# EAGLE design photoduino.shield.v.2.0 (EAGLE 5.10)
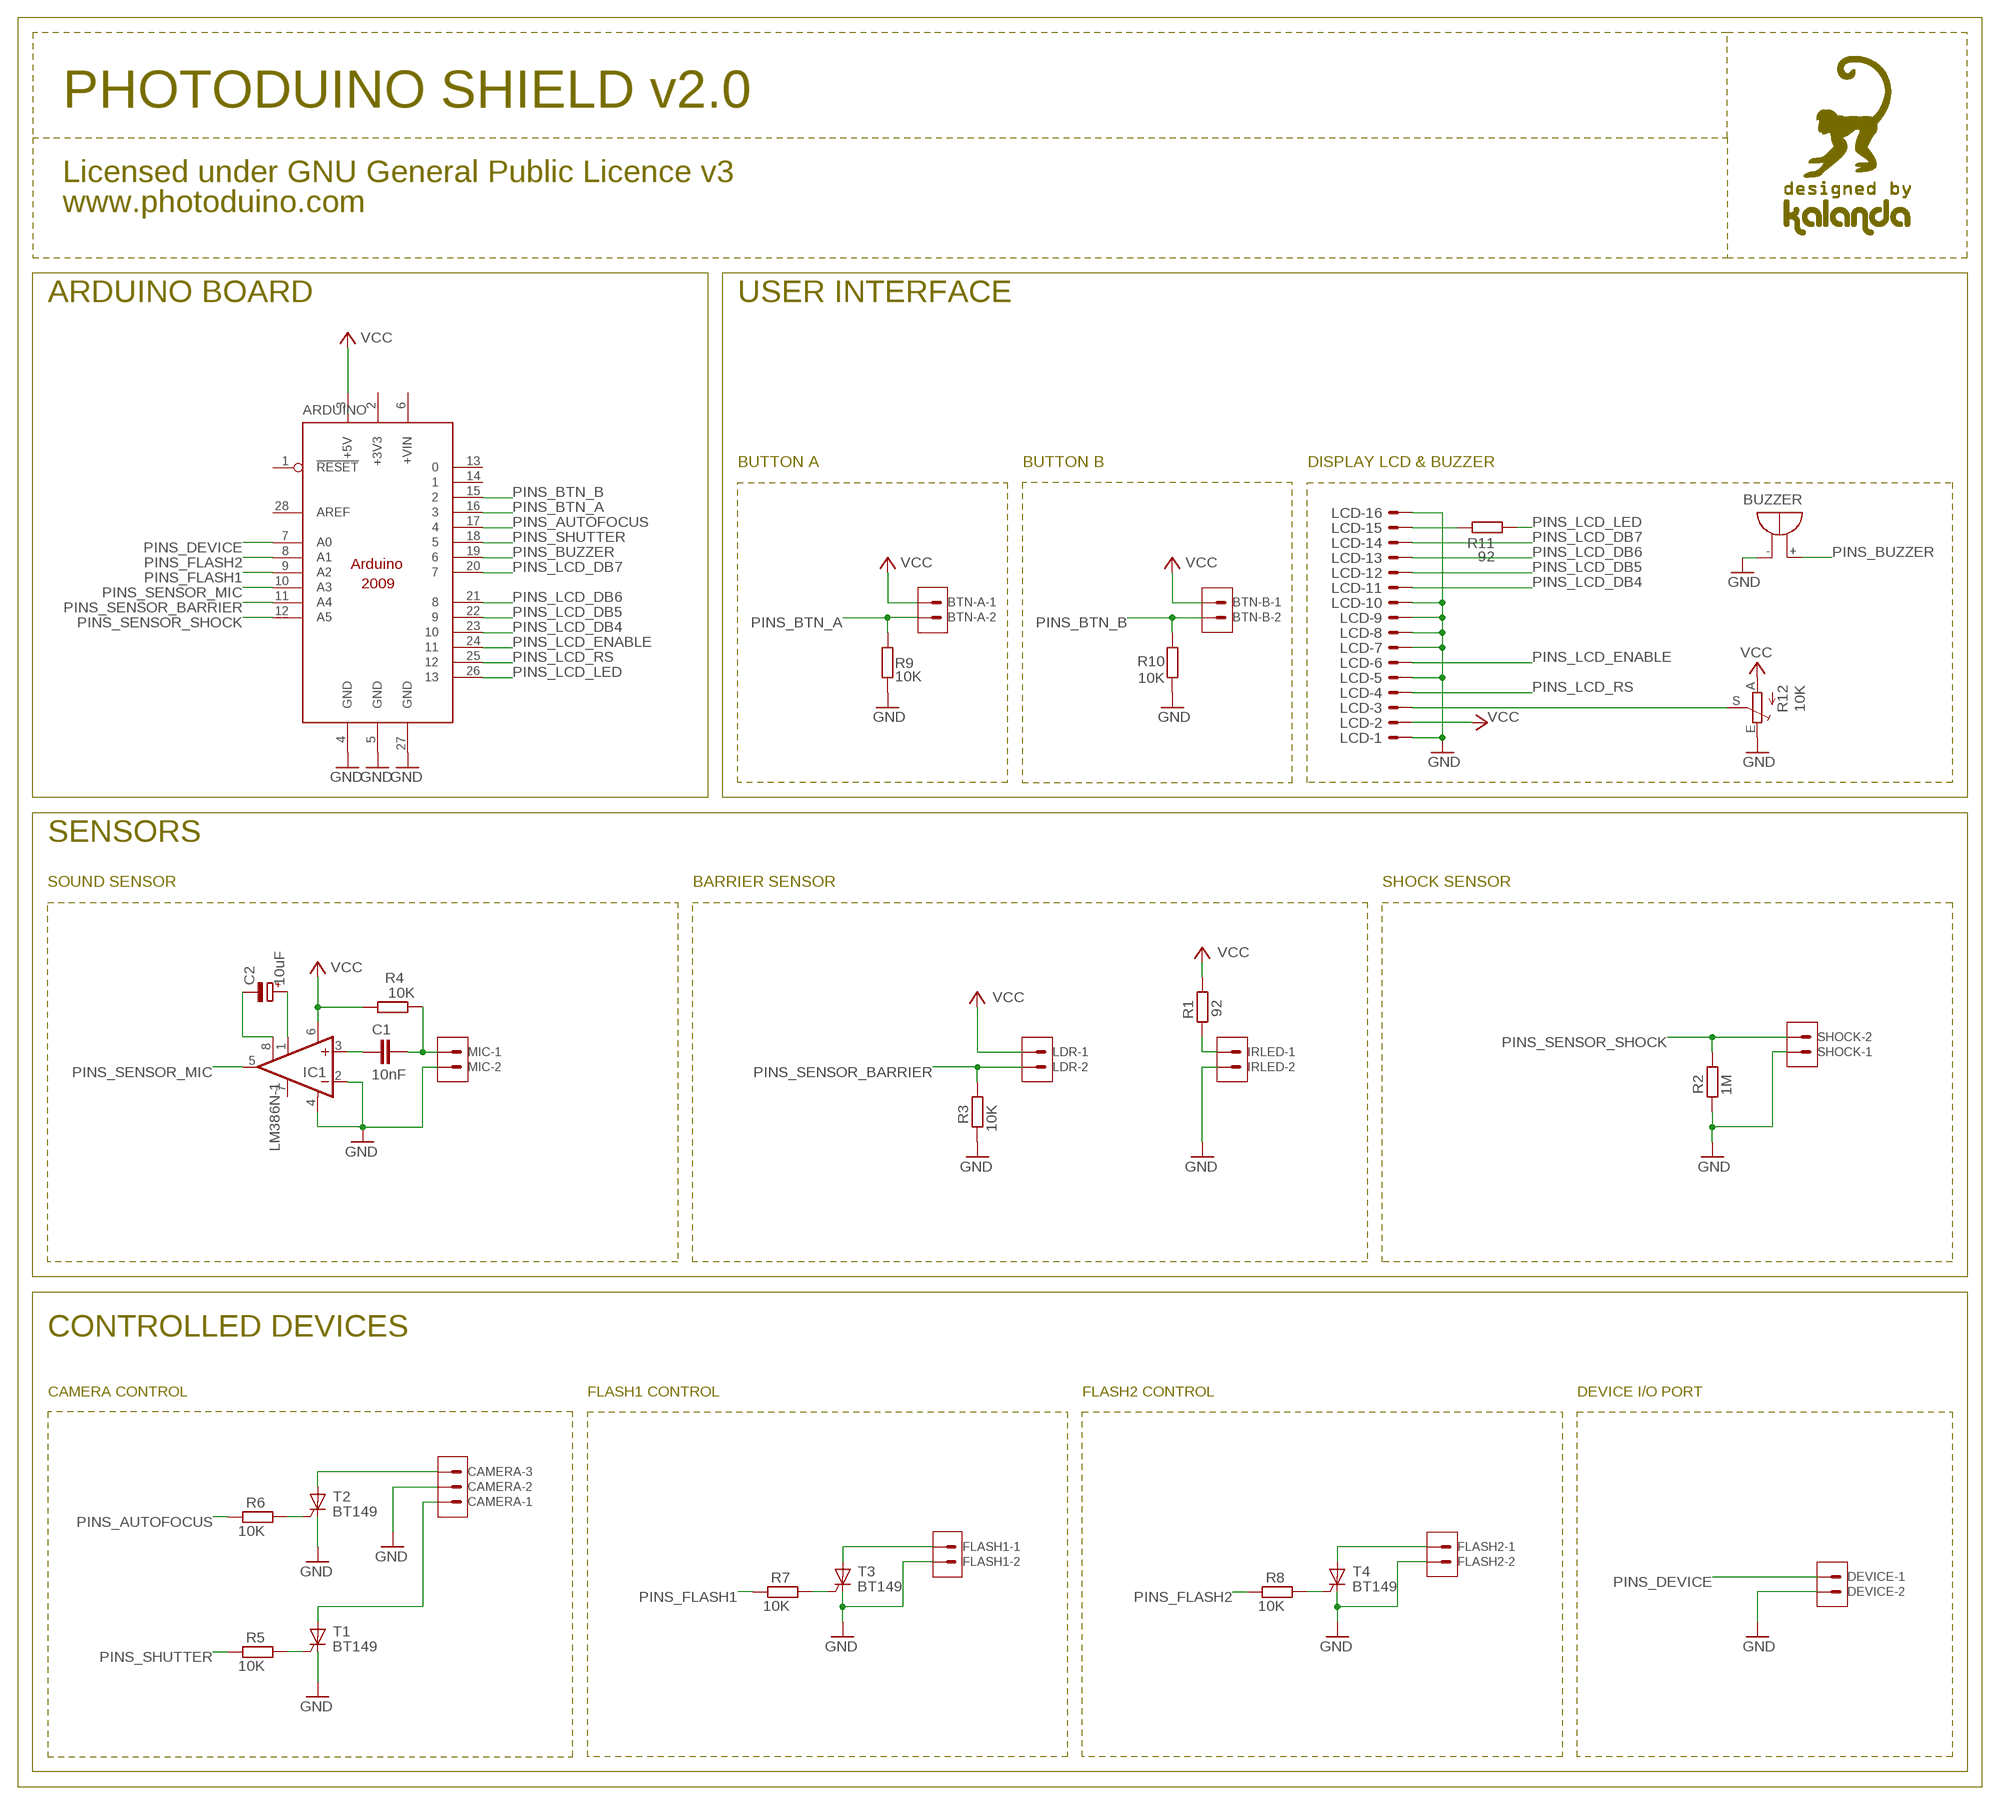
[diagram p0: schematic, sheet 1]

## Parts
ARDUINO  ARDUINO2009_11  [ARDUINO2009_1]
BTN-A  22-27-2021-02  [6410-02]
BTN-B  22-27-2021-02  [6410-02]
BUZZER  F/TMB  [F/TMB]
C1  10nF  C-EU050-025X075  [C050-025X075]
C2  10uF  CPOL-EUE2.5-6  [E2,5-6]
CAMERA  22-27-2031-03  [6410-03]
DEVICE  22-27-2021-02  [6410-02]
FLASH1  22-27-2021-02  [6410-02]
FLASH2  22-27-2021-02  [6410-02]
IC1  LM386N-1  [DIL08]
IRLED  22-27-2021-02  [6410-02]
LCD  ML16E  [ML16]
LDR  22-27-2021-02  [6410-02]
LOGO  LOGOKALANDA  [LOGOKALANDA]
MIC  22-27-2021-02  [6410-02]
R1  92  R-EU_0207/7  [0207/7]
R2  1M  R-EU_0207/7  [0207/7]
R3  10K  R-EU_0207/7  [0207/7]
R4  10K  R-EU_0207/7  [0207/7]
R5  10K  R-EU_0207/7  [0207/7]
R6  10K  R-EU_0207/7  [0207/7]
R7  10K  R-EU_0207/7  [0207/7]
R8  10K  R-EU_0207/7  [0207/7]
R9  10K  R-EU_0207/7  [0207/7]
R10  10K  R-EU_0207/7  [0207/7]
R11  92  R-EU_0207/7  [0207/7]
R12  10K  TRIM_EU-RJ9W  [RJ9W]
SHOCK  22-27-2021-02  [6410-02]
T1  BT149  [TO92-4]
T2  BT149  [TO92-4]
T3  BT149  [TO92-4]
T4  BT149  [TO92-4]

## Nets
GND: ARDUINO.4(GND) ARDUINO.5(GND) ARDUINO.27(GND) BUZZER.- CAMERA.2 DEVICE.2 FLASH1.2 FLASH2.2 IC1.2(-IN) IC1.4(GND) IRLED.2 LCD.1 LCD.5 LCD.7 LCD.8 LCD.9 LCD.10 LCD.16 MIC.2 R2.2 R3.2 R9.1 R10.2 R12.E SHOCK.1 T1.C T2.C T3.C T4.C
LCD_CONTRAST: LCD.3 R12.S
N$1: IRLED.1 R1.2
N$12: C1.1 IC1.3(+IN)
N$16: C1.2 MIC.1 R4.1
N$18: R7.1 T3.G
N$19: R8.1 T4.G
N$21: CAMERA.3 T2.A
N$23: R6.1 T2.G
N$25: R5.1 T1.G
N$27: C2.+ IC1.1(GAIN)
N$29: FLASH2.1 T4.A
N$30: FLASH1.1 T3.A
N$31: C2.- IC1.8(GAIN)
N$32: LCD.15 R11.2
PINS_AUTOFOCUS: ARDUINO.17 R6.2
PINS_BTN_A: ARDUINO.16 BTN-A.2 R9.2
PINS_BTN_B: ARDUINO.15 BTN-B.2 R10.1
PINS_BUZZER: ARDUINO.19 BUZZER.+
PINS_DEVICE: ARDUINO.7(A0) DEVICE.1
PINS_FLASH1: ARDUINO.9(A2) R7.2
PINS_FLASH2: ARDUINO.8(A1) R8.2
PINS_LCD_DB4: ARDUINO.23 LCD.11
PINS_LCD_DB5: ARDUINO.22 LCD.12
PINS_LCD_DB6: ARDUINO.21 LCD.13
PINS_LCD_DB7: ARDUINO.20 LCD.14
PINS_LCD_ENABLE: ARDUINO.24 LCD.6
PINS_LCD_LED: ARDUINO.26 R11.1
PINS_LCD_RS: ARDUINO.25 LCD.4
PINS_SENSOR_BARRIER: ARDUINO.11(A4) LDR.2 R3.1
PINS_SENSOR_MIC: ARDUINO.10(A3) IC1.5(OUT)
PINS_SENSOR_SHOCK: ARDUINO.12(A5) R2.1 SHOCK.2
PINS_SHUTTER: ARDUINO.18 R5.2
SHUTTER: CAMERA.1 T1.A
VCC: ARDUINO.3(+5V) BTN-A.1 BTN-B.1 IC1.6(VS) LCD.2 LDR.1 R1.1 R4.2 R12.A
Unconnected: ARDUINO.1(!RESET) ARDUINO.6(+VIN) ARDUINO.13 ARDUINO.14 ARDUINO.28(AREF) IC1.7(BYPASS)

## Notes on the sheet
- PHOTODUINO SHIELD v2.0
- Licensed under GNU General Public Licence v3
- www.photoduino.com
- ARDUINO BOARD | USER INTERFACE
- BUTTON A | BUTTON B | DISPLAY LCD & BUZZER
- SENSORS
- SOUND SENSOR | BARRIER SENSOR | SHOCK SENSOR
- CONTROLLED DEVICES
- CAMERA CONTROL | FLASH1 CONTROL | FLASH2 CONTROL | DEVICE I/O PORT

## Power pins joined to a net without a drawn wire
+3V3: ARDUINO.2(+3V3)

## Library data of the parts
ARDUINO = componentes:ARDUINO2009_1: The Arduino Duemilanove ("2009") is a microcontroller board based on the ATmega168 or ATmega328. - 14 digital input/output pins (of which 6 can be used as PWM outputs) - 6 analog inputs, a 16 MHz crystal oscillator - USB connection - power jack - ISP header - reset button It contains everything needed to support the microcontroller; simply connect it to a computer with a USB cable or power it with a AC-to-DC adapter or battery to get started http://arduino.cc/en/Main/ArduinoBoardDuemilanove
BTN-A BTN-B DEVICE FLASH1 FLASH2 IRLED LDR MIC SHOCK = componentes:22-?-02: CONNECTOR wire to board 2.54 mm (.1 inch) pitch header
BUZZER = buzzer:F/TMB: BUZZER Source: Buerklin
C1 = resistor:C-EU: CAPACITOR, European symbol
C2 = resistor:CPOL-EU: POLARIZED CAPACITOR, European symbol
CAMERA = componentes:22-?-03: CONNECTOR wire to board 2.54 mm (.1 inch) pitch header
IC1 = linear:LM386?-*: Low Voltage Audio Power Amplifier Source: http://cache.national.com/ds/LM/LM386.pdf
LCD = con-ml:ML16E: HARTING
LOGO = componentes:LOGOKALANDA
R1-R11 = resistor:R-EU_: RESISTOR, European symbol
R12 = pot:TRIM_EU-: POTENTIOMETER
T1-T4 = triac:BT149: THYRISTOR

## Board
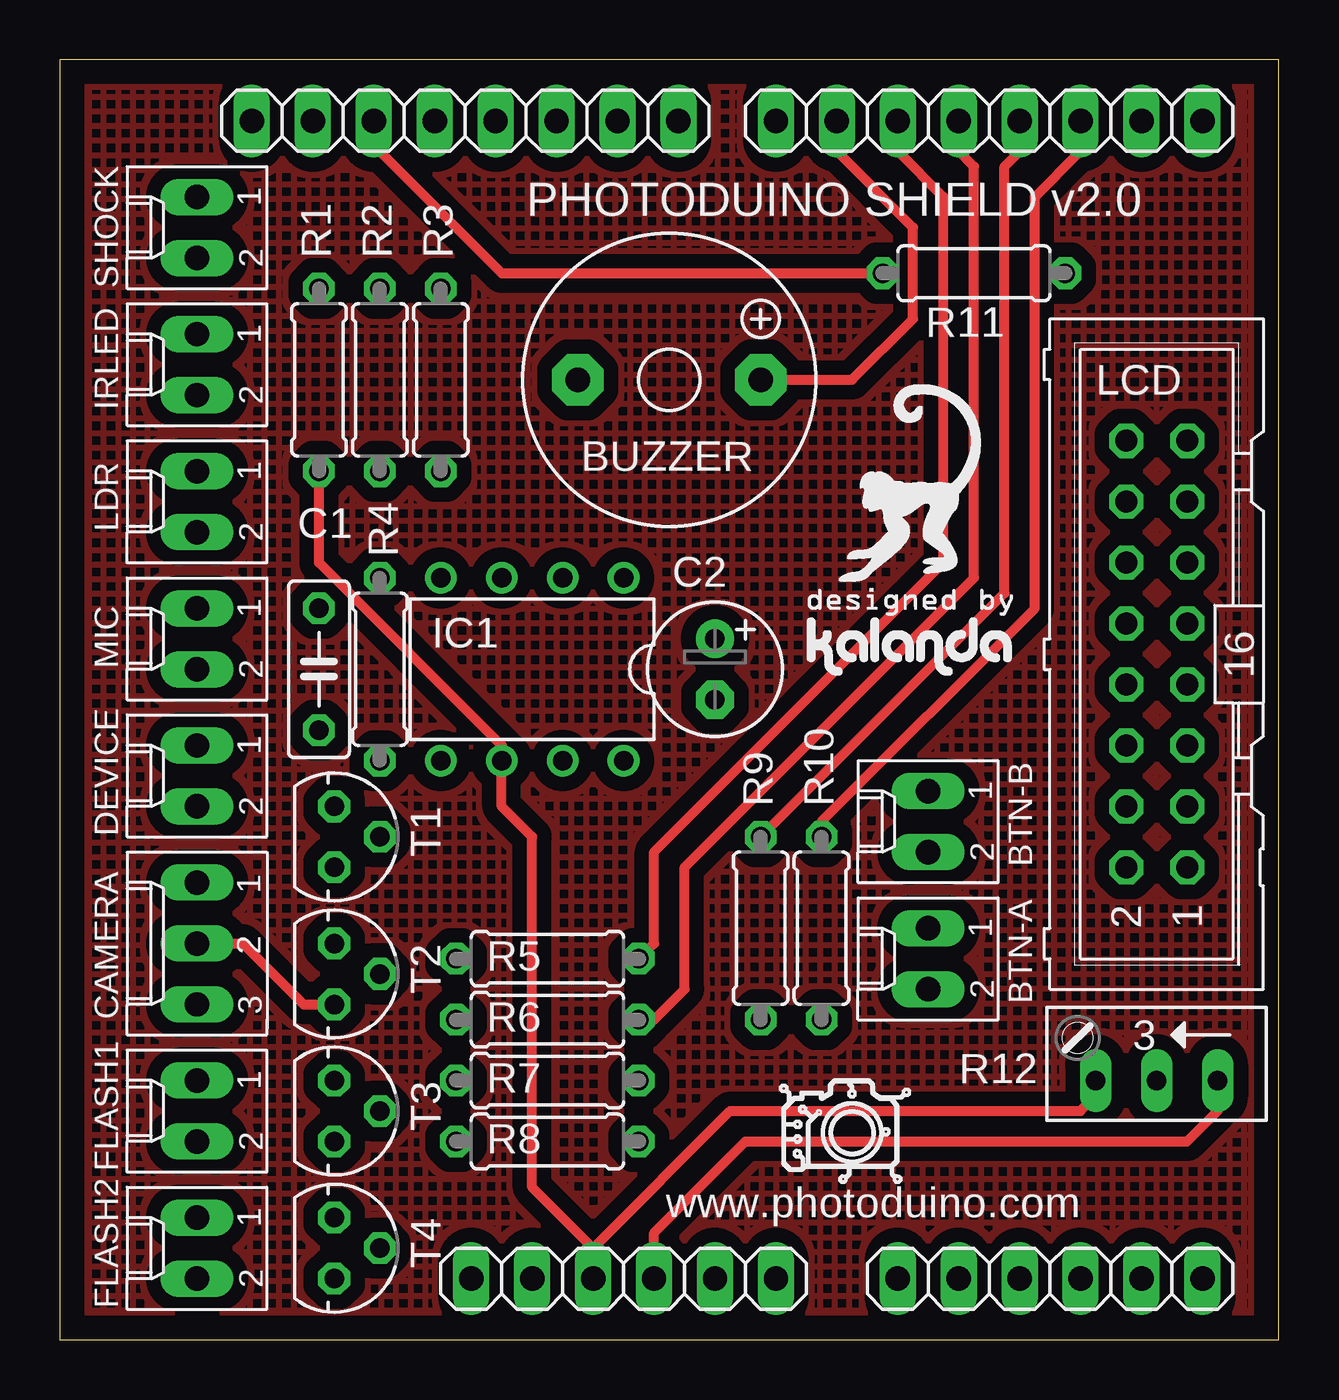
[diagram p1: board, top side]
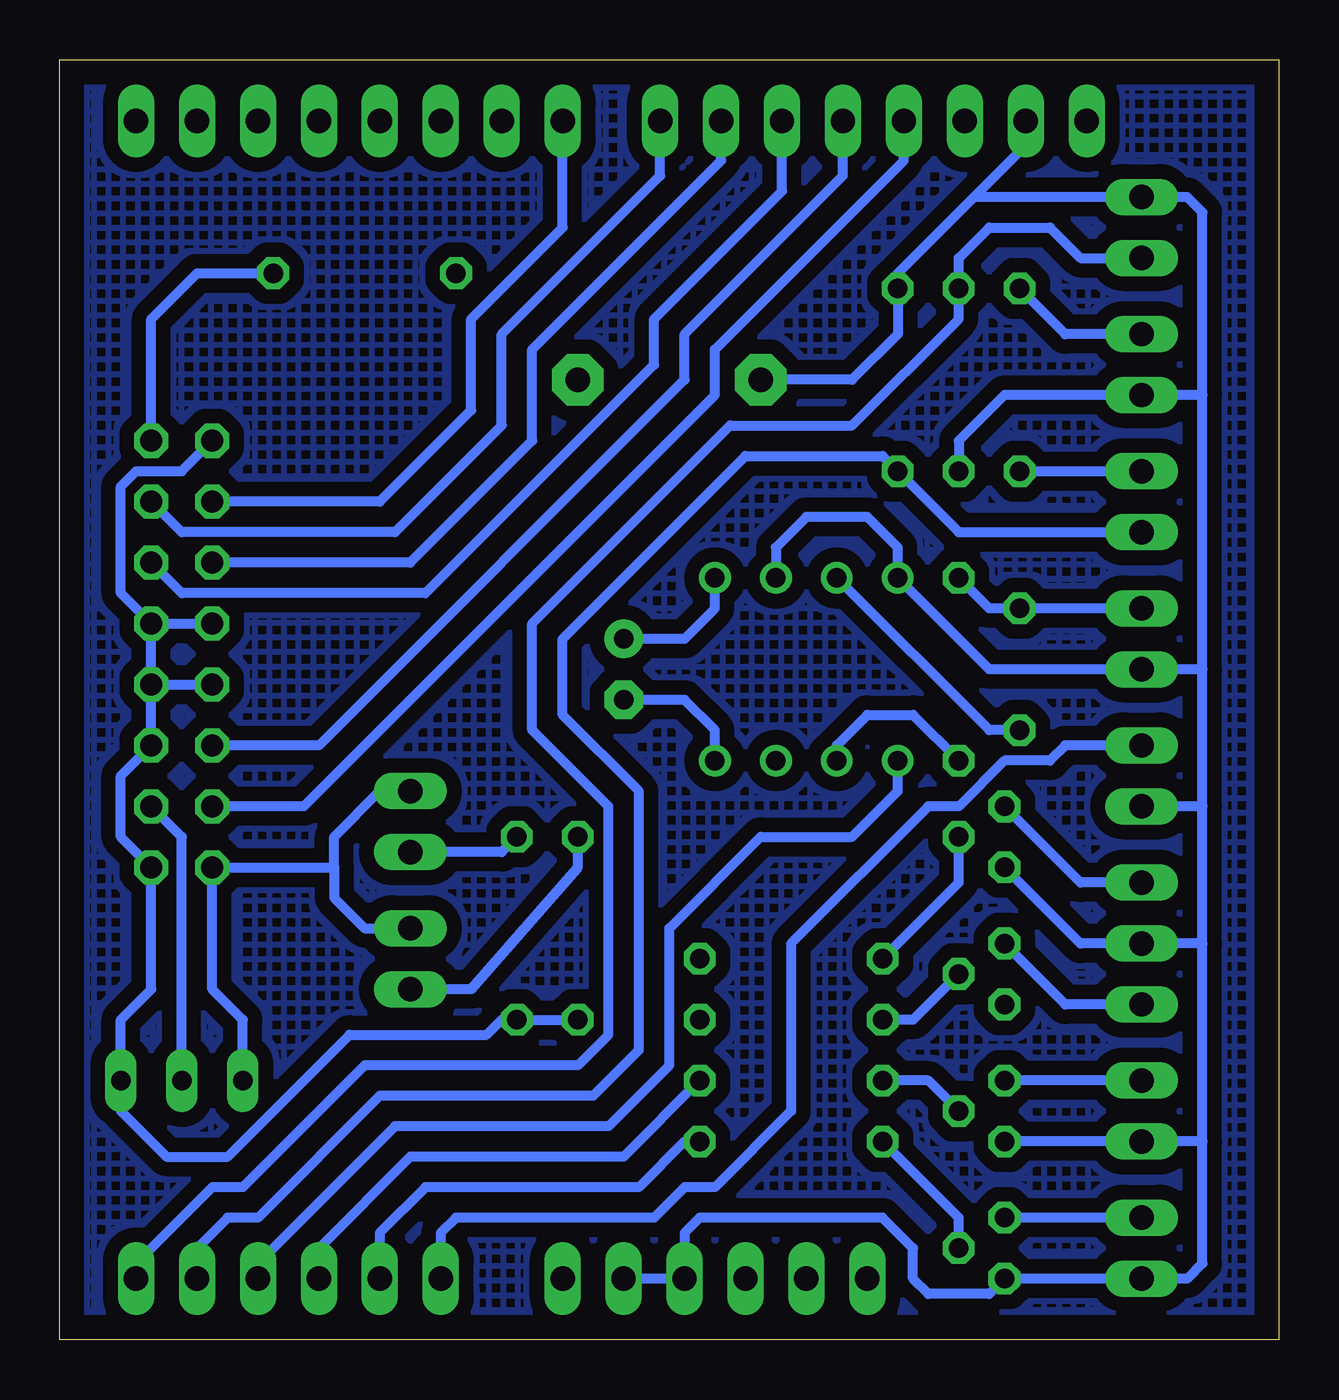
[diagram p2: board, bottom side, seen from below]

Size 50.8 x 53.34 mm. Coordinates in mm from the lower left corner, seen from the top.
Outline: 0,0 50.8,0 50.8,53.34 0,53.34 0,0
Copper layers (1*16): Top 0.035mm / dielectric 1.5mm / Bottom 0.035mm
Design rules "default": minimum track width 10mil, minimum drill 24mil, track to track 8mil, track to pad 8mil, pad to pad 8mil, via to via 8mil, smd to smd 8mil, copper to edge 40mil, drill to drill 8mil, minimum pad ring 10mil, minimum via ring 8mil, stop-mask expansion 4mil, vias tented up to drill 0mil, thermal gap 10mil

### Footprints (pad centres in the part's own frame; a part is rotated, then mirrored left to right if it is on the bottom)
ARDUINO2009_1 = drill 1.016 long: 1 33.02,2.54; 2 35.56,2.54; 3 38.1,2.54; 4 40.64,2.54; 5 43.18,2.54; 6 45.72,2.54; 7 50.8,2.54; 8 53.34,2.54; 9 55.88,2.54; 10 58.42,2.54; 11 60.96,2.54; 12 63.5,2.54; 13 63.5,50.8; 14 60.96,50.8; 15 58.42,50.8; 16 55.88,50.8; 17 53.34,50.8; 18 50.8,50.8; 19 48.26,50.8; 20 45.72,50.8; 21 41.656,50.8; 22 39.116,50.8; 23 36.576,50.8; 24 34.036,50.8; 25 31.496,50.8; 26 28.956,50.8; 27 26.416,50.8; 28 23.876,50.8
6410-02 = drill 1.016 long: 1 1.27,0; 2 -1.27,0
F/TMB = drill 1.016 pad 2.159 octagon: + 3.81,0; - -3.81,0
C050-025X075 = drill 0.813 octagon: 1 -2.54,0; 2 2.54,0
E2,5-6 = drill 0.813 pad 1.6 round: + -1.27,0 | drill 0.813 pad 1.6 octagon: - 1.27,0
6410-03 = drill 1.016 long: 1 2.54,0; 2 0,0; 3 -2.54,0
DIL08 = drill 0.813 pad 1.27 round: 1 -3.81,-3.81; 2 -1.27,-3.81; 3 1.27,-3.81; 4 3.81,-3.81; 5 3.81,3.81; 6 1.27,3.81; 7 -1.27,3.81; 8 -3.81,3.81
ML16 = drill 0.914 octagon: 1 -8.89,-1.27; 2 -8.89,1.27; 3 -6.35,-1.27; 4 -6.35,1.27; 5 -3.81,-1.27; 6 -3.81,1.27; 7 -1.27,-1.27; 8 -1.27,1.27; 9 1.27,-1.27; 10 1.27,1.27; 11 3.81,-1.27; 12 3.81,1.27; 13 6.35,-1.27; 14 6.35,1.27; 15 8.89,-1.27; 16 8.89,1.27
0207/7 = drill 0.813 octagon: 1 -3.81,0; 2 3.81,0
RJ9W = drill 0.813 long: A 2.54,0.635; E -2.54,0.635; S 0,0.635
TO92-4 = drill 0.813 octagon: A -1.27,0; C 1.27,0; G 0,1.905

### Placement (x,y rotation side)
ARDUINO  -15.88,0 0 top
BTN-A  36.2,15.88 90 top
BTN-B  36.2,21.59 90 top
BUZZER  25.4,40.01 0 top
C1  10.79,27.94 90 top
C2  27.3,27.94 270 top
CAMERA  5.71,16.51 90 top
DEVICE  5.71,23.5 90 top
FLASH1  5.71,9.53 90 top
FLASH2  5.71,3.81 90 top
IC1  19.68,27.94 180 top
IRLED  5.71,40.64 90 top
LCD  45.72,28.57 90 top
LDR  5.71,34.92 90 top
LOGO  35.56,29.84 0 top
MIC  5.71,29.21 90 top
R1  10.79,40.01 90 top
R2  13.34,40.01 270 top
R3  15.88,40.01 90 top
R4  13.34,27.94 270 top
R5  20.32,15.88 0 top
R6  20.32,13.34 0 top
R7  20.32,10.79 0 top
R8  20.32,8.26 0 top
R9  29.21,17.14 90 top
R10  31.75,17.14 270 top
R11  38.1,44.45 0 top
R12  45.72,11.43 180 top
SHOCK  5.71,46.35 90 top
T1  11.43,20.95 270 top
T2  11.43,15.24 270 top
T3  11.43,9.53 270 top
T4  11.43,3.81 270 top
U$1  [LOGOPHOTODUINO]  33.02,8.26 0 top

### Tracks (layer width: path | path; a pad name or v marks a point on that pad's centre or on a via)
GND
  Top 0.406: R12.E 48.26,9.53 46.99,8.26 28.57,8.26 24.77,4.45 ARDUINO.4 | T2.C 10.16,13.97 7.62,16.51 CAMERA.2
  Bottom 0.406: 3.17,8.26 3.17,3.17 3.81,2.54 FLASH2.2 T4.C 12.06,1.91 14.61,1.91 15.24,2.54 15.24,3.81 16.51,5.08 24.13,5.08 24.77,4.45 ARDUINO.4 ARDUINO.5 | 3.17,8.26 3.17,16.51 | 3.17,16.51 3.17,22.23 | 3.17,22.23 3.17,27.94 | 3.17,27.94 3.17,39.37 | 3.17,39.37 3.17,46.99 3.81,47.62 SHOCK.1 12.7,47.62 | 3.17,39.37 IRLED.2 11.43,39.37 13.34,37.47 R2.2 | 3.17,27.94 MIC.2 12.06,27.94 IC1.4 15.88,33.02 17.14,34.29 19.68,34.29 20.95,33.02 IC1.2 | 3.17,22.23 DEVICE.2 | 3.17,16.51 CAMERA.2 8.26,16.51 T1.C | 3.17,8.26 FLASH1.2 T3.C | BUZZER.- 17.78,40.01 15.88,41.91 R3.2 15.88,44.45 12.7,47.62 | R9.1 R10.2 32.38,13.34 33.02,12.7 38.73,12.7 43.81,7.62 46.35,7.62 48.26,9.53 R12.E 48.26,13.34 46.99,14.61 LCD.1 48.26,20.95 48.26,23.5 LCD.5 LCD.7 | LCD.7 LCD.9 | LCD.9 LCD.10 | LCD.9 48.26,31.11 48.26,35.56 47.62,36.2 45.72,36.2 LCD.16 | ARDUINO.27 10.54,49.78 12.7,47.62 | LCD.7 LCD.8
LCD_CONTRAST
  Bottom 0.406: R12.S 45.72,20.95 LCD.3
N$1
  Bottom 0.406: IRLED.1 8.89,41.91 R1.2
N$2
  pour Bottom (isolate 0.61, hatched): 0,53.34 50.8,53.34 50.8,0 0,0
N$3
  pour Top (isolate 0.61, hatched): 0,53.34 50.8,53.34 50.8,0 0,0
N$12
  Bottom 0.406: C1.1 12.06,25.4 IC1.3
N$16
  Bottom 0.406: MIC.1 C1.2 12.06,30.48 R4.1
N$18
  Bottom 0.406: R7.1 14.61,10.79 T3.G
N$19
  Bottom 0.406: R8.1 13.34,5.08 T4.G
N$21
  Bottom 0.406: CAMERA.3 8.89,13.97 T2.A
N$23
  Bottom 0.406: T2.G 15.24,13.34 R6.1
N$25
  Bottom 0.406: T1.G 13.34,19.05 R5.1
N$27
  Bottom 0.406: C2.+ 24.77,29.21 23.5,30.48 IC1.1
N$29
  Bottom 0.406: FLASH2.1 T4.A
N$30
  Bottom 0.406: FLASH1.1 T3.A
N$31
  Bottom 0.406: C2.- 24.77,26.67 23.5,25.4 IC1.8
N$32
  Bottom 0.406: R11.2 45.09,44.45 46.99,42.55 LCD.15
PINS_AUTOFOCUS
  Top 0.406: R6.2 24.77,13.34 26.04,14.61 26.04,19.68 38.1,31.75 38.1,48.9 37.47,49.53 ARDUINO.17
PINS_BTN_A
  Top 0.406: ARDUINO.16 40.01,49.53 39.37,48.9 39.37,31.11 R9.2
  Bottom 0.406: R9.2 29.21,19.68 33.66,14.61 BTN-A.2
PINS_BTN_B
  Top 0.406: R10.1 31.75,21.59 40.64,30.48 40.64,47.62 42.55,49.53 ARDUINO.15
  Bottom 0.406: R10.1 32.38,20.32 BTN-B.2
PINS_BUZZER
  Top 0.406: ARDUINO.19 32.38,49.53 35.56,46.35 35.56,42.55 33.02,40.01 BUZZER.+
PINS_DEVICE
  Bottom 0.406: ARDUINO.7 34.92,4.45 34.29,5.08 26.04,5.08 24.77,6.35 23.5,6.35 20.32,9.53 20.32,16.51 14.61,22.23 13.34,22.23 11.43,24.13 9.53,24.13 8.89,24.77 DEVICE.1
PINS_FLASH1
  Bottom 0.406: ARDUINO.9 40.01,3.81 36.2,7.62 27.3,7.62 R7.2
PINS_FLASH2
  Bottom 0.406: R8.2 24.77,8.26 26.67,6.35 35.56,6.35 37.47,4.45 ARDUINO.8
PINS_LCD_DB4
  Bottom 0.406: ARDUINO.23 20.7,47.88 26.04,42.55 26.04,40.64 35.56,31.11 45.72,31.11 LCD.11
PINS_LCD_DB5
  Bottom 0.406: LCD.12 36.2,32.38 31.11,37.47 31.11,41.27 23.24,49.15 ARDUINO.22
PINS_LCD_DB6
  Bottom 0.406: LCD.13 45.72,33.66 36.83,33.66 32.38,38.1 32.38,41.91 25.78,48.51 ARDUINO.21
PINS_LCD_DB7
  Bottom 0.406: LCD.14 37.47,34.92 33.66,38.73 33.66,42.55 29.84,46.35 ARDUINO.20
PINS_LCD_ENABLE
  Bottom 0.406: LCD.6 40.01,24.77 24.77,40.01 24.77,41.91 18.16,48.51 ARDUINO.24
PINS_LCD_LED
  Top 0.406: ARDUINO.26 13.08,49.78 18.41,44.45 R11.1
PINS_LCD_RS
  Bottom 0.406: ARDUINO.25 15.62,49.15 23.5,41.27 23.5,39.37 40.64,22.23 LCD.4
PINS_SENSOR_BARRIER
  Bottom 0.406: LDR.2 13.34,33.66 R3.1 16.51,36.83 22.23,36.83 29.84,29.21 29.84,26.04 26.67,22.86 26.67,12.06 28.57,10.16 37.47,10.16 42.55,5.08 43.81,5.08 45.09,3.81 ARDUINO.11
PINS_SENSOR_MIC
  Bottom 0.406: IC1.5 15.88,22.86 17.78,20.95 21.59,20.95 25.4,17.14 25.4,11.43 27.94,8.89 36.83,8.89 42.55,3.17 ARDUINO.10
PINS_SENSOR_SHOCK
  Bottom 0.406: SHOCK.2 8.26,45.09 9.53,46.35 12.06,46.35 13.34,45.09 R2.1 13.34,42.55 17.78,38.1 22.86,38.1 31.11,29.84 31.11,25.4 27.94,22.23 27.94,12.7 29.21,11.43 38.1,11.43 43.18,6.35 44.45,6.35 47.62,3.17 ARDUINO.12
PINS_SHUTTER
  Top 0.406: R5.2 24.77,16.51 24.77,20.32 36.83,32.38 36.83,47.62 34.92,49.53 ARDUINO.18
SHUTTER
  Bottom 0.406: CAMERA.1 8.26,19.05 T1.A
VCC
  Top 0.406: R1.1 10.79,32.38 18.41,24.77 IC1.6 18.41,22.23 19.68,20.95 19.68,6.35 22.23,3.81 | ARDUINO.3 22.23,3.81 | R12.A 43.18,10.16 42.55,9.53 27.94,9.53 22.23,3.81
  Bottom 0.406: R1.1 LDR.1 | R12.A 43.18,13.34 44.45,14.61 LCD.2 39.37,19.68 | R4.2 15.24,26.04 17.14,26.04 18.41,24.77 IC1.6 | BTN-B.1 37.47,22.86 39.37,20.95 39.37,19.68 | BTN-A.1 38.1,17.14 39.37,18.41 39.37,19.68

### Text on the board
tPlace: PHOTODUINO SHIELD v2.0 | www.photoduino.com